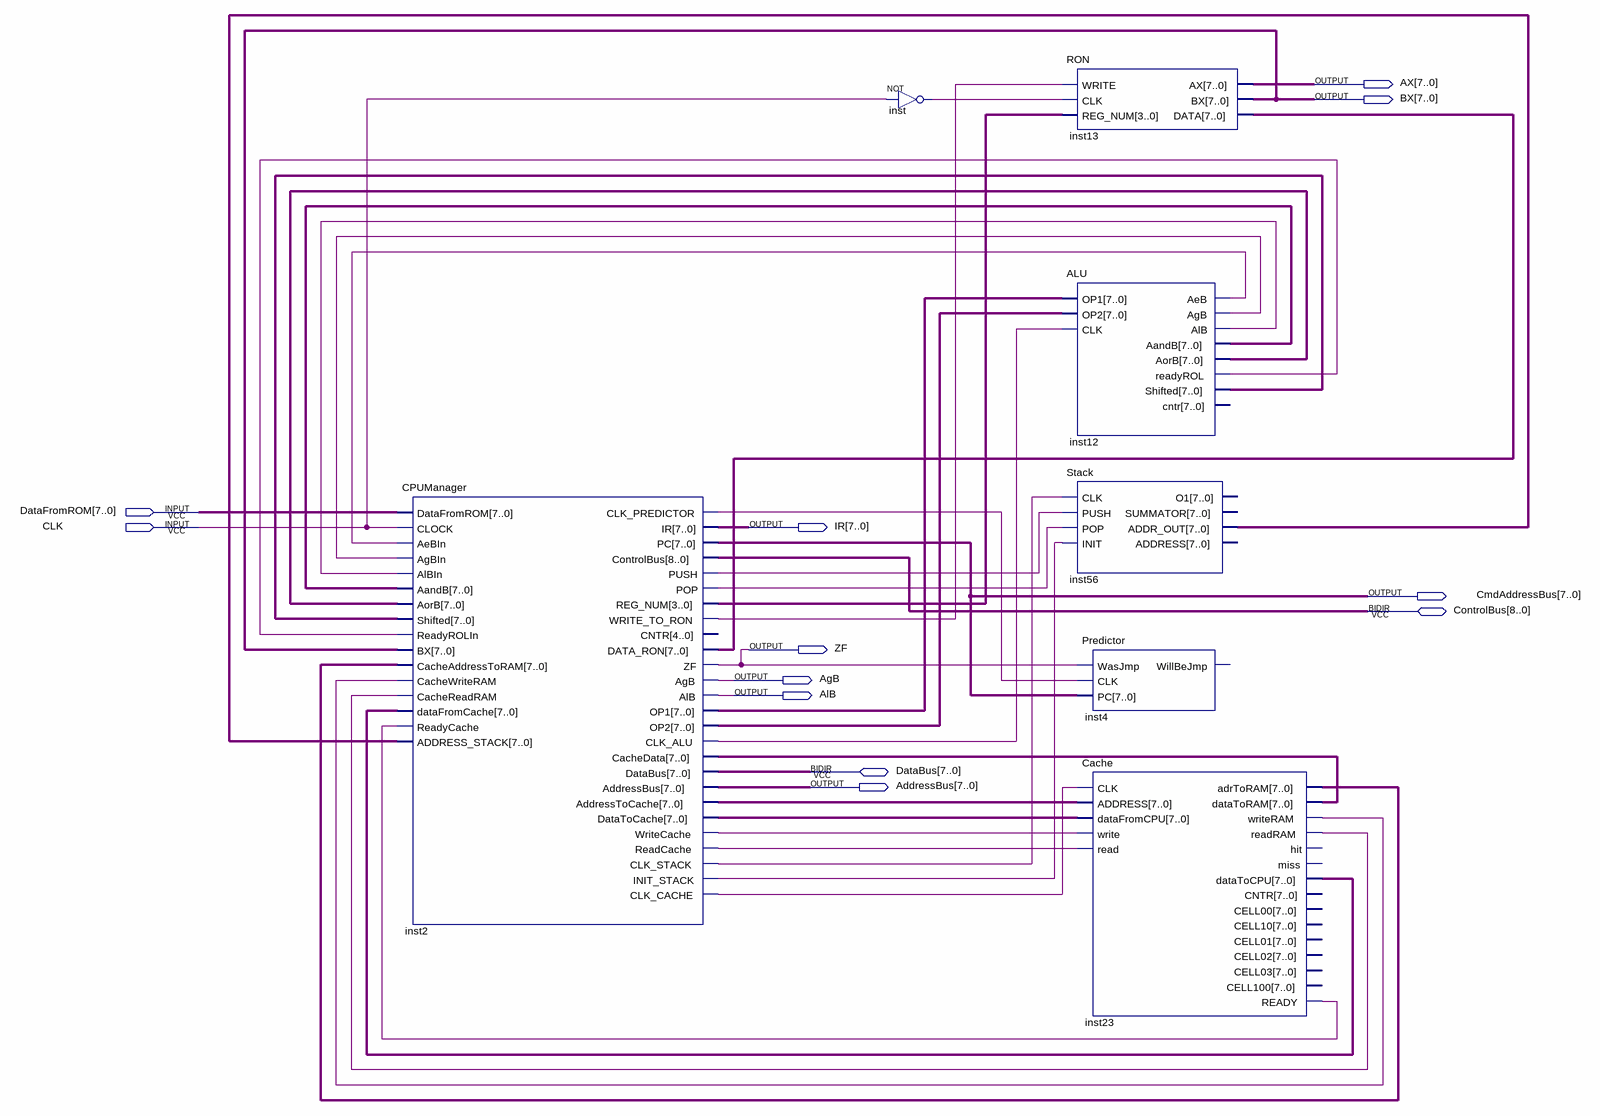
[diagram p0: schematic sheet]
// Quartus schematic CPU.bdf as structural Verilog: 7 symbols, 12 pins
module CPU (
  input  [7:0] DataFromROM,
  input  CLK,
  inout  [8:0] ControlBus,
  inout  [7:0] DataBus,
  output [7:0] AX,
  output [7:0] BX,
  output [7:0] IR,
  output [7:0] CmdAddressBus,
  output ZF,
  output AgB,
  output AlB,
  output [7:0] AddressBus
);

  wire inst2_clk_alu, inst2_clk_cache, inst2_clk_predictor, inst2_clk_stack, inst2_init_stack, inst2_pop,
       inst2_push, inst2_readcache, inst2_write_to_ron, inst2_writecache, inst12_aeb, inst12_agb, inst12_alb,
       inst12_readyrol, inst23_readram, inst23_ready, inst23_writeram, inst_out;
  wire [3:0] inst2_reg_num;
  wire [7:0] inst2_addresstocache, inst2_cachedata, inst2_data_ron, inst2_datatocache, inst2_op1, inst2_op2,
       inst12_aandb, inst12_aorb, inst12_shifted, inst23_adrtoram, inst23_datatocpu, inst56_addr_out;

  CPUManager inst2 (
    .DataFromROM(DataFromROM), .CLOCK(CLK), .AeBIn(inst12_aeb), .AgBIn(inst12_agb), .AlBIn(inst12_alb),
    .AandB(inst12_aandb), .AorB(inst12_aorb), .Shifted(inst12_shifted), .ReadyROLIn(inst12_readyrol),
    .BX(BX), .CacheAddressToRAM(inst23_adrtoram), .CacheWriteRAM(inst23_writeram),
    .CacheReadRAM(inst23_readram), .dataFromCache(inst23_datatocpu), .ReadyCache(inst23_ready),
    .ADDRESS_STACK(inst56_addr_out), .CLK_PREDICTOR(inst2_clk_predictor), .IR(IR), .PC(CmdAddressBus),
    .PUSH(inst2_push), .POP(inst2_pop), .REG_NUM(inst2_reg_num), .WRITE_TO_RON(inst2_write_to_ron), .ZF(ZF),
    .AgB(AgB), .AlB(AlB), .OP1(inst2_op1), .OP2(inst2_op2), .CLK_ALU(inst2_clk_alu), .AddressBus(AddressBus),
    .AddressToCache(inst2_addresstocache), .DataToCache(inst2_datatocache), .WriteCache(inst2_writecache),
    .ReadCache(inst2_readcache), .CLK_STACK(inst2_clk_stack), .INIT_STACK(inst2_init_stack),
    .CLK_CACHE(inst2_clk_cache), .ControlBus(ControlBus), .DATA_RON(inst2_data_ron),
    .CacheData(inst2_cachedata), .DataBus(DataBus));  // open: CNTR
  not inst (inst_out, CLK);
  RON inst13 (
    .WRITE(inst2_write_to_ron), .CLK(inst_out), .REG_NUM(inst2_reg_num), .AX(AX), .BX(BX),
    .DATA(inst2_data_ron));
  ALU inst12 (
    .OP1(inst2_op1), .OP2(inst2_op2), .CLK(inst2_clk_alu), .AeB(inst12_aeb), .AgB(inst12_agb),
    .AlB(inst12_alb), .AandB(inst12_aandb), .AorB(inst12_aorb), .readyROL(inst12_readyrol),
    .Shifted(inst12_shifted));  // open: cntr
  Stack inst56 (
    .CLK(inst2_clk_stack), .PUSH(inst2_push), .POP(inst2_pop), .INIT(inst2_init_stack),
    .ADDR_OUT(inst56_addr_out));  // open: O1, SUMMATOR, ADDRESS
  Predictor inst4 (.WasJmp(ZF), .CLK(inst2_clk_predictor), .PC(CmdAddressBus));  // open: WillBeJmp
  Cache inst23 (
    .CLK(inst2_clk_cache), .ADDRESS(inst2_addresstocache), .dataFromCPU(inst2_datatocache),
    .write(inst2_writecache), .read(inst2_readcache), .adrToRAM(inst23_adrtoram), .writeRAM(inst23_writeram),
    .readRAM(inst23_readram), .dataToCPU(inst23_datatocpu), .READY(inst23_ready), .dataToRAM(inst2_cachedata));  // open: hit, miss, CNTR, CELL00, CELL10, CELL01, CELL02, CELL03, CELL100
endmodule
